# Altium schematic sheet 无线20191228.SCHDOC
size A4; PageSetup: Record=PageOptions|CenterHorizontal=True|CenterVertical=True|PrintScale=1.00|XCorrection=1.00|YCorrection=1.00|PrintKind=2|BorderSize=5000000|LeftOffset=0|BottomOffset=0|Orientation=2|PaperLength=1000|PaperWidth=1000|Scale=100|PaperSource=7|PrintQuality=-4|MediaType=1|DitherType=10|PaperKind=A4|PrintScaleMode=1
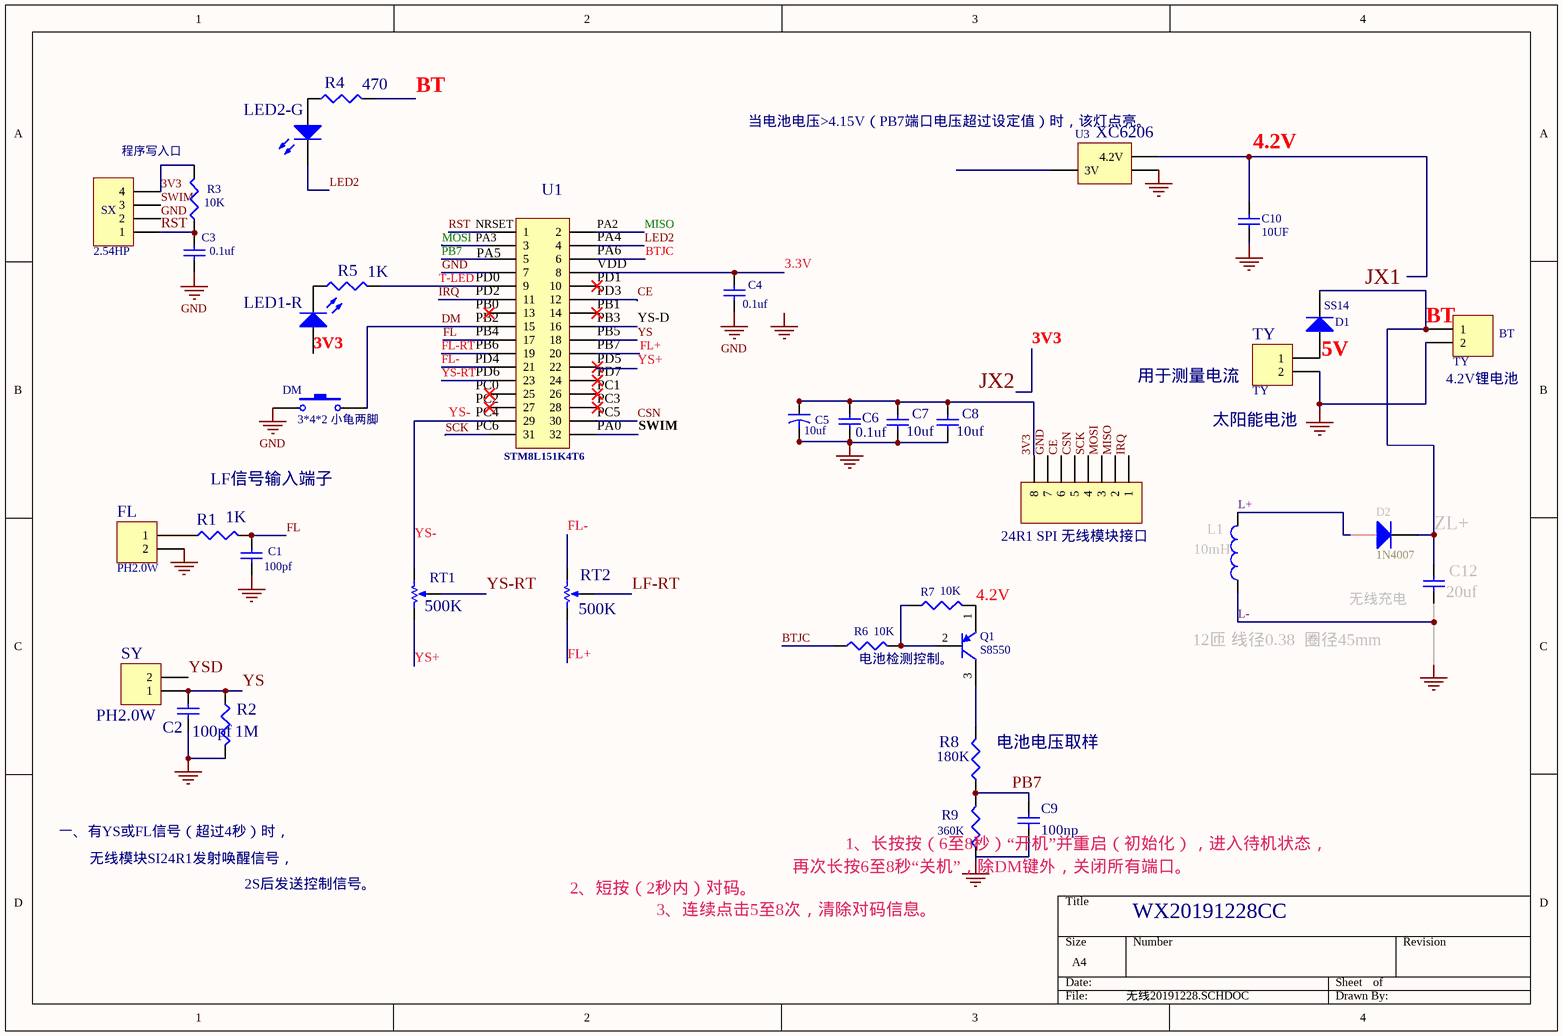
[diagram p0: 无线20191228.SCHDOC]

## Parts
24R1_SPI_无线模块接口  Header 8  [HDR1X8]  (value not drawn)
BT  TY  [HDR1X2]
C1  100pf  [CC1608-0603]
C2  100pf  [CC1608-0603]
C3  value 0.1uf  [CC1608-0603]  (hidden comment: Cap Semi)
C4  value 0.1uf  [CC1608-0603]
C5  10uf  [CAPPR2-5x6.8]
C6  0.1uf  [CC1608-0603]
C7  10uf  [CC1608-0603]
C8  10uf  [CC1608-0603]
C9  100np  [CC1608-0603]
C10  value 10UF  [CC1608-0603]
C12  value 20uf  [CC1608-0603]
D1  SS14  [DIO7.1-3.9x1.9]
D2  1N4007  [DIO7.1-3.9x1.9]
DM  3*4*2 小龟两脚  [SPST-2]
FL  PH2.0W  [HDR1X2]
L1  12匝 线径0.38  圈径45mm  value 10mH  [INDC1005-0402]
LED1-R  (no value)  [LED-0]
LED2-G  (no value)  [LED-0]
Q1  S8550  [BCY-W3/E4]
R1  value 1K  [C1608-0603]
R2  value 1M  [C1608-0603]
R3  value 10K  [C1608-0603]
R4  470  [C1608-0603]
R5  1K  [C1608-0603]
R6  10K  [C1608-0603]
R7  10K  [C1608-0603]
R8  value 180K  [C1608-0603]
R9  value 360K  [C1608-0603]
RT1  500K  [VR5]
RT2  500K  [VR5]
SX  2.54HP  [HDR1X4]
SY  PH2.0W  [HDR1X2]
TY  TY  [HDR1X2]
U1  STM8L151K4T6  [HDR2X16]
U3  XC6206  [MHDR2X2]

## Nets
GND: 24R1_SPI_无线模块接口.7 BT.2 C1.1 C2.1 C3.1 C4.1 C5.2 C6.1 C7.1 C8.1 C9.1 C10.2 C12.2 DM.1 FL.2 L1.2 R2.1 R9.1 SX.2 TY.2 U1.7 U3.3.3OUT  [also labelled L-]
3.3V: C4.2 U1.8
3V3: 24R1_SPI_无线模块接口.8 LED1-R.1(A) R3.2 SX.4
4.2V: Q1.1(E) R7.1
BT: BT.1 C12.1 D1.2(K) D2.2(K) R4.2  [also labelled JX1, ZL+]
BTJC: R6.2 U1.6
CE: 24R1_SPI_无线模块接口.6 U1.12
CSN: 24R1_SPI_无线模块接口.5 U1.30
DM: DM.2 U1.15
FL: C1.2 R1.1 U1.17
FL+: RT2.2(BOT) U1.20
FL-: RT2.1(TOP) U1.21
FL-RT: U1.19
IRQ: 24R1_SPI_无线模块接口.1 U1.11
L+: D2.1(A) L1.1
LED2: LED2-G.2(K) U1.4
LF-RT: RT2.3(TAP)
MISO: 24R1_SPI_无线模块接口.2 U1.2  [also labelled PA2]
MOSI: 24R1_SPI_无线模块接口.3 U1.3  [also labelled PA3]
NRSET: C3.2 R3.1 SX.1 U1.1  [also labelled RST]
PB7: C9.2 R8.1 R9.2 U1.5
SCK: 24R1_SPI_无线模块接口.4 U1.31
SWIM: SX.3 U1.32
T-LED: R5.2 U1.9
YS: C2.2 R2.2 SY.1 U1.18
YS+: RT1.2(BOT) U1.22
YS-: RT1.1(TOP) U1.29
YS-D: U1.16
YS-RT: RT1.3(TAP) U1.23
YSD: SY.2
NetC5_1: C5.1 C6.2 C7.2 C8.2
NetC10_1: C10.1 U3.3.3_IN(4.2V)
NetD1_1: D1.1(A) TY.1
NetFL_1: FL.1 R1.2
NetLED1-R_2: LED1-R.2(K) R5.1
NetLED2-G_1: LED2-G.1(A) R4.1
NetQ1_2: Q1.2(B) R6.1 R7.2
NetQ1_3: Q1.3(C) R8.2

Not connected (* = marked no-connect by the designer): U1 10* 13* 14* 24 25 26 27 28; U3 2(3V)

## Notes on the sheet
- 程序写入口
- 当电池电压>4.15V（PB7端口电压超过设定值）时，该灯点亮。
- (near U1) PA4
- (near U1) PD0
- (near U1) PD2
- (near U1) PB0
- (near U1) PA5
- (near U1) PA6
- (near U1) PD1
- (near U1) PD3
- (near U1) PB1
- (near U1) VDD
- (near U1) PD4
- (near U1) PD6
- (near U1) PB2
- (near U1) PB4
- (near U1) PB6
- (near U1) PB7
- (near U1) PD5
- (near U1) PD7
- (near U1) PB3
- (near U1) PB5
- 用于测量电流
- (near BT) 4.2V锂电池
- (near U1) PC0
- (near U1) PC2
- (near U1) PC4
- (near U1) PC6
- (near U1) PA0
- (near U1) PC1
- (near U1) PC3
- (near U1) PC5
- 太阳能电池
- LF信号输入端子
- 无线充电
- (near R6) 电池检测控制。
- (near R8) 电池电压取样
- 一、有YS或FL信号（超过4秒）时，
- 1、长按按（6至8秒）“开机”并重启（初始化），进入待机状态，
- 无线模块SI24R1发射唤醒信号，
- 2S后发送控制信号。
- 2、短按（2秒内）对码。
- 3、连续点击5至8次，清除对码信息。
- 再次长按6至8秒“关机”，除DM键外，关闭所有端口。
- WX20191228CC
- Labels drawn without touching a wire or pin: 4.2V, 5V, GND, JX2

## Library data of the parts
24R1_SPI_无线模块接口 = Header 8: Header, 8-Pin; LatestRevisionDate: 17-Jul-2002; LatestRevisionNote: Re-released for DXP Platform.; Publisher: Altium Limited
BT FL SY TY = Header 2: Header, 2-Pin; LatestRevisionDate: 17-Jul-2002; LatestRevisionNote: Re-released for DXP Platform.; Publisher: Altium Limited
C1-C4 C10 C12 = Cap Semi: Capacitor (Semiconductor SIM Model); Published: 8-Jun-2000; LatestRevisionDate: 17-Jul-2002; LatestRevisionNote: Re-released for DXP Platform.; PackageReference: C1206; Publisher: Altium Limited
  C1 C2: Value: 100pF
C5 = Cap2: Capacitor; Published: 23-Sep-2002; Publisher: Altium Limited; Value: 10uf
C6 = Cap Semi: Capacitor (Semiconductor SIM Model); Value: 10UF; Published: 8-Jun-2000; LatestRevisionDate: 17-Jul-2002; LatestRevisionNote: Re-released for DXP Platform.; PackageReference: C1206; Publisher: Altium Limited
C7-C9 = Cap Semi: Capacitor (Semiconductor SIM Model); Value: 100pF; Published: 8-Jun-2000; LatestRevisionDate: 17-Jul-2002; LatestRevisionNote: Re-released for DXP Platform.; PackageReference: C1206; Publisher: Altium Limited
D1 D2 = Diode 1N4148: High Conductance Fast Diode; Published: 8-Jun-2000; LatestRevisionDate: 17-Jul-2002; LatestRevisionNote: Re-released for DXP Platform.; Publisher: Altium Limited; Code_JEDEC: DO-204-AH; DatasheetDocument: 1997; PackageReference: DO-35
DM = SW-PB: Switch; Published: 24-Mar-1999; LatestRevisionDate: 17-Jul-2002; LatestRevisionNote: Re-released for DXP Platform.; Publisher: Altium Limited
L1 = Inductor: Code_IEC: 1005; Published: 8-Jun-2000; LatestRevisionDate: 17-Jul-2002; LatestRevisionNote: Re-released for DXP Platform.; PackageReference: 0402-A; Publisher: Altium Limited; Code_JEITA: 0402
LED1-R LED2-G = LED0: Typical INFRARED GaAs LED; Published: 8-Jun-2000; LatestRevisionDate: 17-Jul-2002; LatestRevisionNote: Re-released for DXP Platform.; Publisher: Altium Limited
Q1 = 2N3906: PNP General Purpose Amplifier; Published: 8-Jun-2000; LatestRevisionDate: 15-Jan-2003; LatestRevisionNote: PCB Footprint 'BCY-W3/D4.7' replaced; DatasheetDocument: 1997; PackageReference: TO-92A; Publisher: Altium Limited; Code_JEDEC: TO-92A
R1-R9 = Res3: Resistor; Published: 8-Jun-2000; LatestRevisionDate: 17-Jul-2002; LatestRevisionNote: Re-released for DXP Platform.; Publisher: Altium Limited
RT1 RT2 = RPot: Potentiometer; Sim Note: Enter the Resistance value and the set point into parameter fields.; Set Position: 0.5; Published: 8-Jun-2000; LatestRevisionDate: 17-Jul-2002; LatestRevisionNote: Re-released for DXP Platform.; Publisher: Altium Limited
SX = Header 4: Header, 4-Pin; LatestRevisionDate: 17-Jul-2002; LatestRevisionNote: Re-released for DXP Platform.; Publisher: Altium Limited
U1 = Header 16X2: Header, 16-Pin, Dual row; LatestRevisionDate: 17-Jul-2002; LatestRevisionNote: Re-released for DXP Platform.; Publisher: Altium Limited
U3 = MHDR2X2: Header, 2-Pin, Dual row; LatestRevisionDate: 17-Jul-2002; LatestRevisionNote: Re-released for DXP Platform.; Publisher: Altium Limited